# Altium schematic sheet ADC.SchDoc
size A4
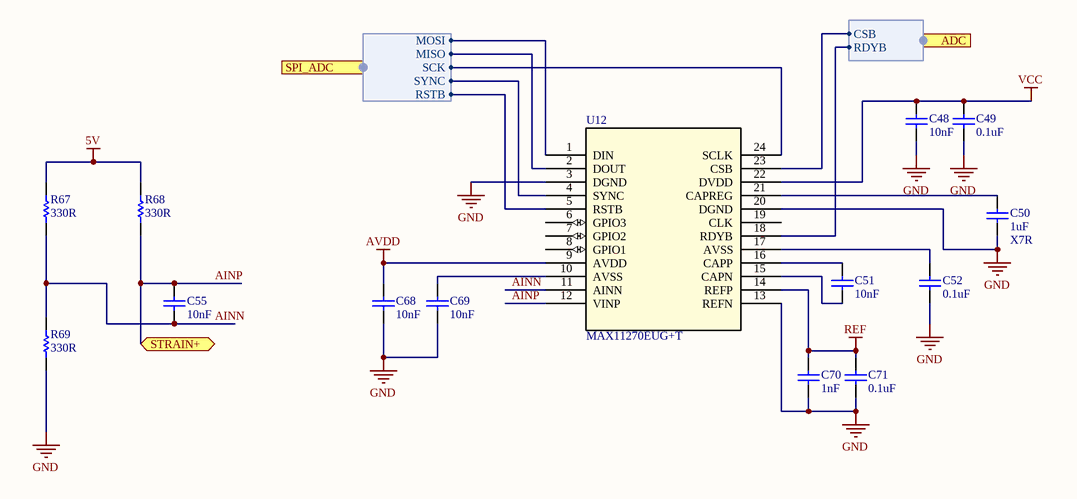
[diagram p0: ADC.SchDoc]

## Parts
C48  value 10nF  [C0603[1608X92]]  (hidden comment: 10nF 6.3V 0603)
C49  value 0.1uF  [C0603[1608X92]]  (hidden comment: 0.1uF 6.3V 0603)
C50  value 1uF  TemperatureCoefficient: X7R  [C0603[1608X92]]  (hidden comment: 1uF 16V 0603 X7R)
C51  value 10nF  [C0603[1608X92]]  (hidden comment: 10nF 6.3V 0603)
C52  value 0.1uF  [C0603[1608X92]]  (hidden comment: 0.1uF 6.3V 0603)
C55  value 10nF  [C0603[1608X92]]  (hidden comment: 10nF 6.3V 0603)
C68  value 10nF  [C0603[1608X92]]  (hidden comment: 10nF 6.3V 0603)
C69  value 10nF  [C0603[1608X92]]  (hidden comment: 10nF 6.3V 0603)
C70  value 1nF  [C0603[1608X92]]  (hidden comment: 1nF 6.3V 0603)
C71  value 0.1uF  [C0603[1608X92]]  (hidden comment: 0.1uF 6.3V 0603)
R67  value 330R  [R0603[1608]]  (hidden comment: 330R 0.1% 0603)
R68  value 330R  [R0603[1608]]  (hidden comment: 330R 0.1% 0603)
R69  value 330R  [R0603[1608]]  (hidden comment: 330R 0.1% 0603)
U12  MAX11270EUG+T  [21-0066J_24]

## Ports
ADC (harness ADC), SPI_ADC (harness SPI_ADC), STRAIN+ (bidir)

## Harnesses
SPI_ADC: MOSI, MISO, SCK, SYNC, RSTB
ADC: CSB, RDYB

## Nets
5V: R67.2 R68.2
AVDD: C68.2 U12.9(AVDD)
GND: C48.1 C49.1 C50.1 C52.1 C68.1 C69.1 C70.1 C71.1 R69.1 U12.3(DGND) U12.13(REFN) U12.20(DGND)
REF: C70.2 C71.2 U12.14(REFP)
VCC: C48.2 C49.2 U12.22(DVDD)
AINN: C55.1 R67.1 R69.2 U12.11(AINN)
AINP: C55.2 R68.1 U12.12(VINP) ; port STRAIN+
NetC50_2: C50.2 U12.21(CAPREG)
NetC51_1: C51.1 U12.15(CAPN)
NetC51_2: C51.2 U12.16(CAPP)
NetC52_2: C52.2 U12.17(AVSS)
NetC69_2: C69.2 U12.10(AVSS)
NetU12_1: U12.1(DIN) ; port SPI_ADC.MOSI
NetU12_2: U12.2(DOUT) ; port SPI_ADC.MISO
NetU12_4: U12.4(SYNC) ; port SPI_ADC.SYNC
NetU12_5: U12.5(RSTB) ; port SPI_ADC.RSTB
NetU12_18: U12.18(RDYB) ; port ADC.RDYB
NetU12_23: U12.23(CSB) ; port ADC.CSB
NetU12_24: U12.24(SCLK) ; port SPI_ADC.SCK

Not connected (* = marked no-connect by the designer): U12 6(GPIO3) 7(GPIO2) 8(GPIO1) 19(CLK)

## Library data of the parts
C48 C51 C55 C68 C69 = CAP_10nF_6.3V_0603_10%: 10nF 6.3V 10% 0603 (1608 Metric); PartNumber: GRM188R70J103KA01D; Manufacturer: Murata; TemperatureCoefficient: X7R; Mounting Technology: Surface Mount; PackageReference: 0603; PackageDescription: 0603 (1608 Metric); Voltage: 6.3V; Tolerance: 10%
C49 C52 C71 = CAP_0.1uF_6.3V_0603_10%: 0.1uF 6.3V 10% 0603 (1608 Metric); PartNumber: GRM188R70J104KA01D; Manufacturer: Murata; Mounting Technology: Surface Mount; PackageReference: 0603; PackageDescription: 0603 (1608 Metric); Voltage: 6.3V; Tolerance: 10%
C50 = CAP_1uF_16V_0603_10%_X7R: 1uF 16V 10% 0603 X7R (1608 Metric); PartNumber: GCJ188R71E105KA01D; Manufacturer: Murata; Mounting Technology: Surface Mount; PackageReference: 0603; PackageDescription: 0603 (1608 Metric); Voltage: 16V; Tolerance: 10%
C70 = CAP_1nF_6.3V_0603_5%: 1nF 6.3V 5% 0603 (1608 Metric); PartNumber: 06036C102KAT4A; Manufacturer: AVX Corporation; Tolerance: 10%; TemperatureCoefficient: X7R; Mounting Technology: Surface Mount; PackageReference: 0603; PackageDescription: 0603 (1608 Metric); Voltage: 6.3V
R67-R69 = RES_330R_0603_0.1%: 330R 0.2W 1% 0603 (1005 Metric); Manufacturer: Panasonic; PartNumber: ERJ-PB3B3300V; Tolerance: 0.1%; Power: 0.2W; Mounting Technology: Surface Mount; PackageReference: 0603; PackageDescription: 0603 (1608 Metric); ComponentLink1Description: Datasheet; ComponentLink1URL: http://www.vishay.com/docs/20043/crcwhpe3.pdf
U12 = MAX11270EUG+T: Imported; PartNumber: MAX111270EUG+T; Manufacturer: Maxim; Value: Value; Type: Type; RefDes: RefDes